# Altium project HU_SUPPORT_BOARD.PrjPcb (part 2 of 2)

## Sheet ADC088S022.SchDoc
size A4; SheetNumber: 6; SheetTotal: 7
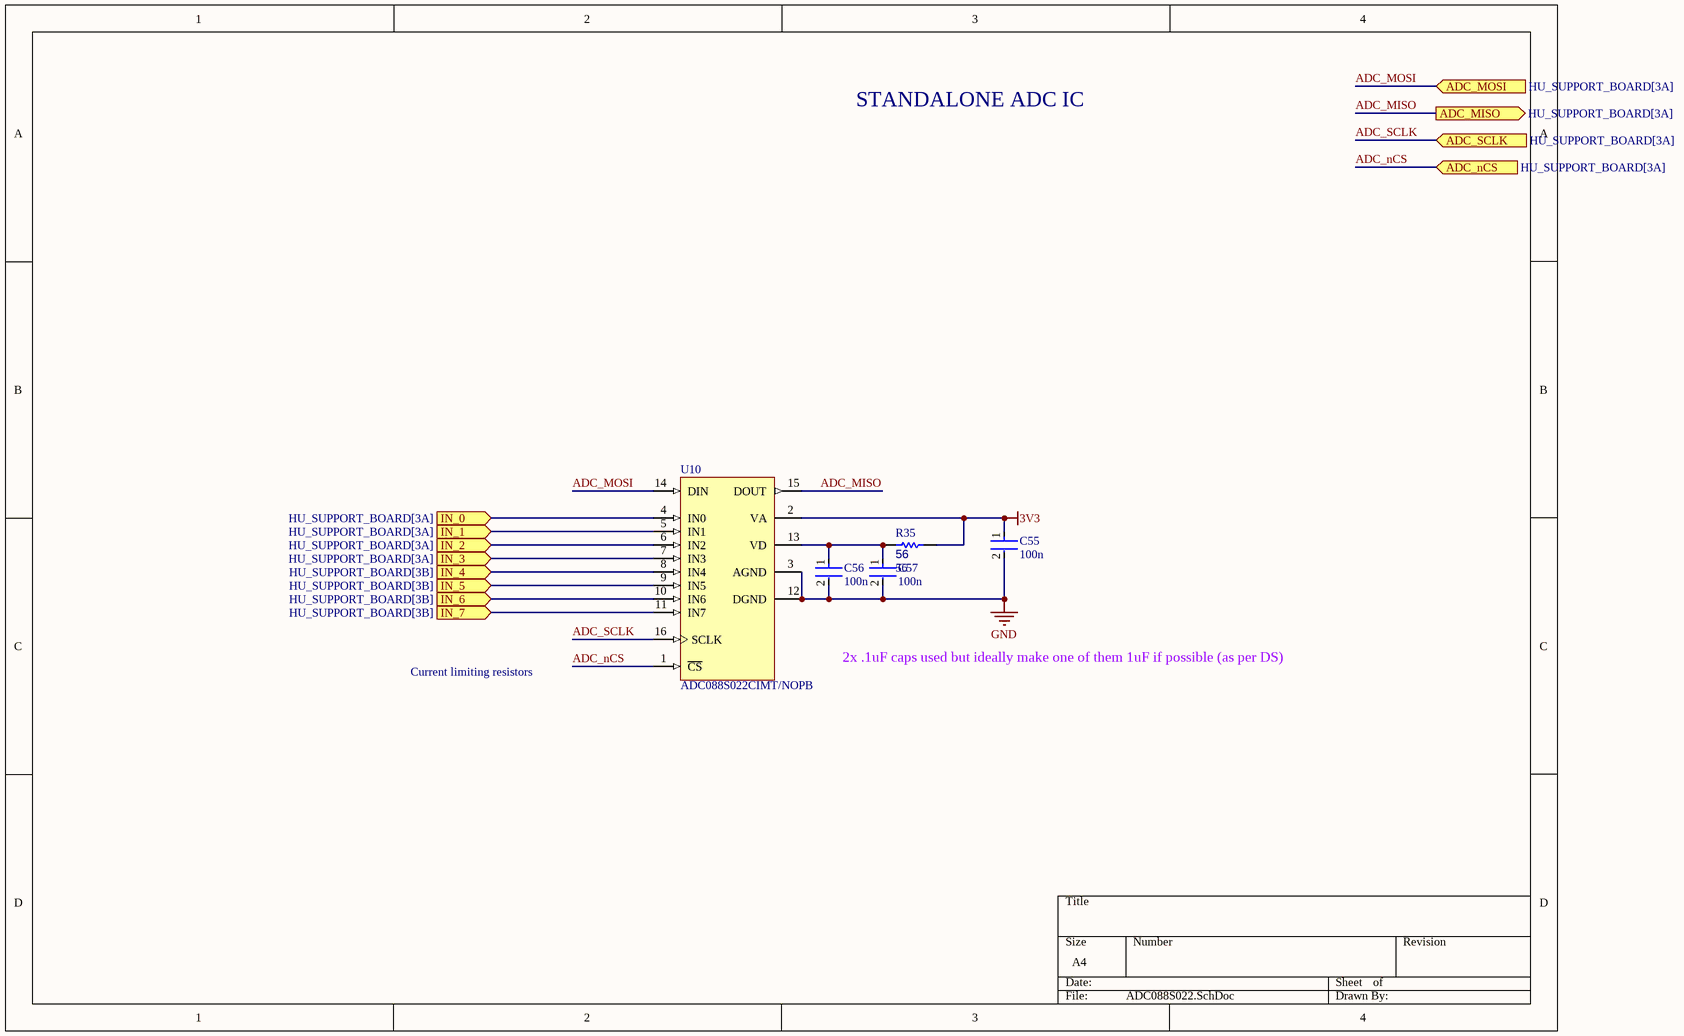
[diagram p9: ADC088S022.SchDoc]

### Parts
C55  100n  [FP-0402-L_1_0_0_05-W_0_5-IPC_A]
C56  100n  [FP-0402-L_1_0_0_05-W_0_5-IPC_A]
C57  100n  [FP-0402-L_1_0_0_05-W_0_5-IPC_A]
R35  56  [R0603B]
U10  ADC088S022CIMT/NOPB  [MTC16_L]

### Ports
ADC_MISO (out, see HU_SUPPORT_BOARD[3A]), ADC_MOSI (in, see HU_SUPPORT_BOARD[3A]), ADC_nCS (in, see HU_SUPPORT_BOARD[3A]), ADC_SCLK (in, see HU_SUPPORT_BOARD[3A]), IN_0 (in, see HU_SUPPORT_BOARD[3A]), IN_1 (in, see HU_SUPPORT_BOARD[3A]), IN_2 (in, see HU_SUPPORT_BOARD[3A]), IN_3 (in, see HU_SUPPORT_BOARD[3A]), IN_4 (in, see HU_SUPPORT_BOARD[3B]), IN_5 (in, see HU_SUPPORT_BOARD[3B]), IN_6 (in, see HU_SUPPORT_BOARD[3B]), IN_7 (in, see HU_SUPPORT_BOARD[3B])

### Nets
3V3: C55.1 R35.1 U10.2(VA)
GND: C55.2 C56.2 C57.2 U10.3(AGND) U10.12(DGND)
ADC_MISO: U10.15(DOUT) ; port ADC_MISO
ADC_MOSI: U10.14(DIN) ; port ADC_MOSI
ADC_nCS: U10.1(~{CS}) ; port ADC_nCS
ADC_SCLK: U10.16(SCLK) ; port ADC_SCLK
NetC56_1: C56.1 C57.1 R35.2 U10.13(VD)
NetR4_5V_REG_0_1: U10.4(IN0) ; port IN_0
NetR4_5V_REG_1_1: U10.6(IN2) ; port IN_2
NetR27_1: U10.9(IN5) ; port IN_5
NetR36_1: U10.8(IN4) ; port IN_4
NetU2_5V_REG_0_7: U10.5(IN1) ; port IN_1
NetU2_5V_REG_1_7: U10.7(IN3) ; port IN_3
NetU7_7: U10.10(IN6) ; port IN_6
NetU10_11: U10.11(IN7) ; port IN_7

### Notes on the sheet
- STANDALONE ADC IC
- Current limiting resistors
- 2x .1uF caps used but ideally make one of them 1uF if possible (as per DS)

### Library data of the parts
C55-C57 = CMP-001-00058-1: LARGE PADS, 0402 CAP, CHANGE COMMENT TO MATCH REAL P/N; Capacitor Type: Ceramic; Min Operating Temperature: -55°C; Mounting Technology: Surface Mount; Pins: 2; Case/Package: 0402; RoHS Compliant: Yes; Max Operating Temperature: 85°C
R35 = CMP-009-00002-14: Resistor; Value: 56
U10 = CMP-0054-00372-2: 8-Channel, 50 kSPS to 200 kSPS, 8-Bit A/D Converter, 16-pin TSSOP, Pb-Free; Manufacturer: National Semiconductor; PackageTopMarking: NSUZXYTT*88S022*CIMT; CompType: ADC IC; PowerWise: Y; ComponentLink2URL: http://www.national.com/pf/AD/ADC088S022.html; RoHS: Y; PackageDescription: Molded TSSOP, Jedec, 5 x 4.4 x 0.9mm Body, 16 Lead, 0.65mm Pitch; DatasheetVersion: Feb-2010; PinCount: 16; ComponentLink1Description: ADC088S022 Datasheet; Code_JEDEC: MO-153-AB; ComponentLink3URL: http://www.national.com/packaging/folders/mtc16.html; PackageVersion: revD, Jun-2003; ComponentLink3Description: MTC16 Package Page; RevisionNote: Component URLs added; ComponentLink1URL: http://www.national.com/ds/AD/ADC088S022.pdf; ComponentLink2Description: ADC088S022 Web Page; PackageReference: MTC16

## Sheet 3V3_LDO.SchDoc
size A4; SheetNumber: 7; SheetTotal: 7
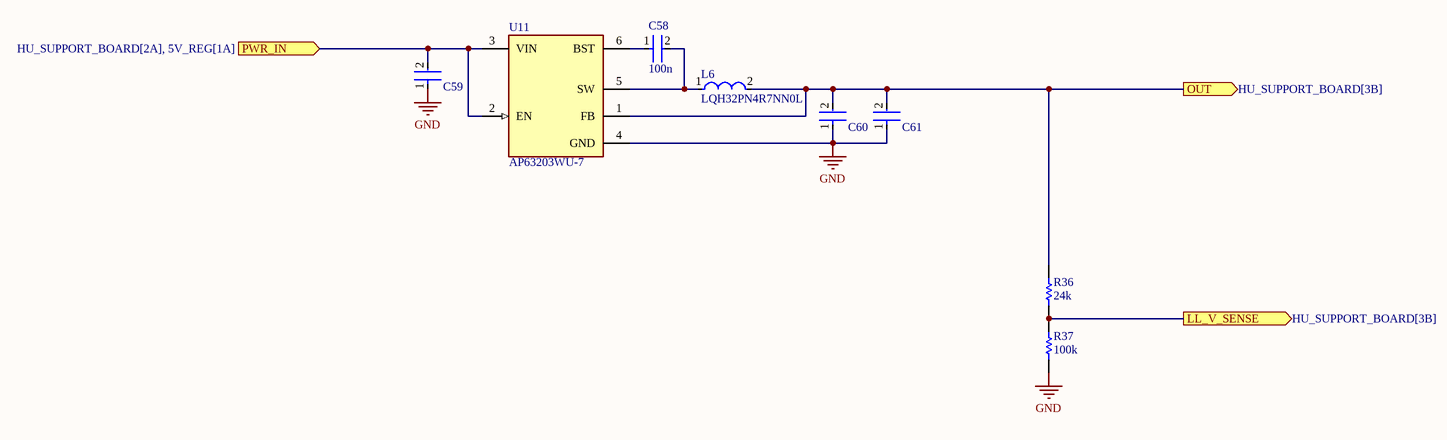
[diagram p10: 3V3_LDO.SchDoc]

### Parts
C58  100n  [FP-0402-L_1_0_0_05-W_0_5-IPC_A]
C59  GRM21BR61E226ME44L  [FP-GRM21B-0_2-e0_2_0_7-IPC_B]  (value not drawn)
C60  GRM21BR61E226ME44L  [FP-GRM21B-0_2-e0_2_0_7-IPC_B]  (value not drawn)
C61  GRM21BR61E226ME44L  [FP-GRM21B-0_2-e0_2_0_7-IPC_B]  (value not drawn)
L6  LQH32PN4R7NN0L  [FP-LQH32PB_N0-MFG]
R36  24k  [R0603B]
R37  100k  [R0603B]
U11  AP63203WU-7  [FP-TSOT26-MFG]

### Ports
LL_V_SENSE (out, see HU_SUPPORT_BOARD[3B]), OUT (out, see HU_SUPPORT_BOARD[3B]), PWR_IN (in, see HU_SUPPORT_BOARD[2A], 5V_REG[1A])

### Nets
3V3: C60.2 C61.2 L6.2 R36.2 U11.1(FB) ; port OUT
GND: C59.1 C60.1 C61.1 R37.1 U11.4(GND)
PoC_PWR: C59.2 U11.2(EN) U11.3(VIN) ; port PWR_IN
NetC58_1: C58.1 U11.6(BST)
NetC58_2: C58.2 L6.1 U11.5(SW)
NetR36_1: R36.1 R37.2 ; port LL_V_SENSE

### Library data of the parts
C58 = CMP-001-00058-1: as C55 on sheet ADC088S022; Min Operating Temperature: -55°C; Mounting Technology: Surface Mount; Pins: 2; Case/Package: 0402; RoHS Compliant: Yes; Max Operating Temperature: 85°C
C59-C61 = CMP-2007-03222-3: Chip Multilayer Ceramic Capacitors for General Purpose, 0805, 22uF, X5R, 15%, 20%, 25V; Case/Package: 0805; Depth: 1.25mm; Resistor Type: Ceramic; Voltage Rating: 25V; Lead Free: Lead Free; Voltage Rating (DC): 25V; Case Code (Metric): 2012; Thickness: 0.057inch; REACH SVHC: No SVHC; Material: Ceramic; Tolerance: 20%; Length: 2mm; Capacitance: 22uF; Case Code (Imperial): 0805; Max Operating Temperature: 85°C; Termination: SMD/SMT; Weight: 0.000335oz; Dielectric: X5R; Packaging: Tape and Reel; Voltage: 25V; Package Quantity: 3000; Height: 1.25mm; Mount: Surface Mount; Width: 1.25mm; Min Operating Temperature: -55°C
L6 = CMP-06042-015002-1: Wire Wound Ferrite Inductor for Power Lines 4.7μH ±30% 0.216Ω 1000mA 1210; DC Current: 1A; Self Resonant Frequency: 40MHz; Test Frequency: 1MHz; Inductance: 4.7uH; Shielding: Shielded; DC Resistance (DCR): 180mR; Case/Package: 1210; Lead Free: Lead Free; Inductance Tolerance: 30%; Depth: 2.8mm; Radiation Hardening: No; Case Code (Imperial): 1210; Length: 3.2mm; Height - Seated (Max): 0.067inch; Current Rating: 1A; Max DC Current: 1A; Core Material: Ferrite; Resistor Type: Wirewound; Max Operating Temperature: 85°C; Weight: 0.001552oz; Tolerance: 30%; Width: 0.098inch; Mount: Surface Mount; Height: 2mm; Termination: SMD/SMT; Package Quantity: 2000; Min Operating Temperature: -40°C; Saturation Current: 1A; Packaging: Tape and Reel; Case Code (Metric): 3225; REACH SVHC: No SVHC; Military Standard: Not
R36 R37 = CMP-009-00002-14: Resistor
U11 = CMP-12757-000006-1: IC REG BUCK 3.3V 2A TSOT26; Manufacturer: Diodes Inc.; Output Type: Fixed; Min Supply Voltage: 3.8V; Number Of Outputs: 1; Max Junction Temp: +160°C; Nominal Supply Current: 22uA; Standoff Height: 0.01mm; Switching Frequency: 1.1MHz; Max Supply Voltage: 32V; ComponentLink2Description: Datasheet; Device Class L1: Integrated Circuits (ICs); Temperature: to +160°C; Device Class L3: Voltage Regulators - Switching; RoHS: TRUE; Octopart: https://octopart.com/ap63203wu-7-diodes+inc.-98099550; Output Voltage: 3.3V; Lead Free: Yes; ComponentLink2URL: https://www.diodes.com/assets/Datasheets/AP63200-AP63201-AP63203-AP63205.pdf; Digikey Description: IC REG BUCK 3.3V 2A TSOT26; Footprint Url: https://www.diodes.com/assets/Package-Files/TSOT26.pdf; Ambient Temperature Range High: +85°C; Height: 1mm; Automotive: No; Temperature Range High: +160°C; Switching Topology: Buck; Output Current: 2A; Package: TSOT26; Category: IC; Mouser Description: AP63203 Series 3.3 V 2 A SMT Fixed Low IQ Synchronous Buck - TSOT-26; Device Class L2: Power Management ICs; Ambient Temperature Range Low: -40°C; Manufacturer Part Number: AP63203WU-7

## Nets that join several sheets
3V3: HU_SUPPORT_BOARD (R1.2), TCAN1146_PWR_MGMT (C45.1 C47.1 U7.8 U8.5), 5V_REG_0 (C10_5V_REG_0.2 R2_5V_REG_0.2 U2_5V_REG_0.8), 5V_REG_1 (C10_5V_REG_1.2 U2_5V_REG_1.8), GMSL_DESERIALIZER (9 pins), MCP2518_PINOUT (5 pins), ADC088S022 (C55.1 R35.1 U10.2), 3V3_LDO (5 pins)
5VA: HU_SUPPORT_BOARD (P1.2 P1.4), 5V_REG_0 (R4_5V_REG_0.2 U2_5V_REG_0.3 U2_5V_REG_0.4)
5VB: HU_SUPPORT_BOARD (F2.2), 5V_REG_1 (R4_5V_REG_1.2 U2_5V_REG_1.3 U2_5V_REG_1.4)
GND: HU_SUPPORT_BOARD (24 pins), TCAN1146_PWR_MGMT (19 pins), 5V_REG_0 (15 pins), 5V_REG_1 (15 pins), GMSL_DESERIALIZER (35 pins), MCP2518_PINOUT (6 pins), ADC088S022 (5 pins), 3V3_LDO (5 pins)
PoC_PWR: HU_SUPPORT_BOARD (J4.7 J4.8 J5.7 J5.8), TCAN1146_PWR_MGMT (5 pins), 5V_REG_0 (5 pins), 5V_REG_1 (5 pins), GMSL_DESERIALIZER (F1.1), 3V3_LDO (C59.2 U11.2 U11.3)
5VB_LL_EN: HU_SUPPORT_BOARD (P1.27 R1.1), 5V_REG_1 (R2_5V_REG_1.2)
ADC_MISO: HU_SUPPORT_BOARD (P1.35), ADC088S022 (U10.15)
ADC_MOSI: HU_SUPPORT_BOARD (P1.38), ADC088S022 (U10.14)
ADC_nCS: HU_SUPPORT_BOARD (P1.12), ADC088S022 (U10.1)
ADC_SCLK: HU_SUPPORT_BOARD (P1.40), ADC088S022 (U10.16)
CAM_I2C_SCL: HU_SUPPORT_BOARD (J2.13), GMSL_DESERIALIZER (R7.1 R11.1 R12.1)
CAM_I2C_SDA: HU_SUPPORT_BOARD (J2.14), GMSL_DESERIALIZER (R6.1 R8.1 R9.1)
CAM_nPWDN: HU_SUPPORT_BOARD (J2.11), GMSL_DESERIALIZER (R13.1 U3.11)
CAN_MISO: HU_SUPPORT_BOARD (P1.21), TCAN1146_PWR_MGMT (U8.6), MCP2518_PINOUT (U6.12)
CAN_MOSI: HU_SUPPORT_BOARD (P1.19), TCAN1146_PWR_MGMT (U8.11), MCP2518_PINOUT (U6.11)
CAN_N: HU_SUPPORT_BOARD (J3.19), TCAN1146_PWR_MGMT (C49.1 D5.1 L5.4 R33.2)
CAN_nCS: HU_SUPPORT_BOARD (P1.26), TCAN1146_PWR_MGMT (U8.14)
CAN_P: HU_SUPPORT_BOARD (J3.18), TCAN1146_PWR_MGMT (C51.2 D5.2 L5.1 R34.1)
CAN_RX: TCAN1146_PWR_MGMT (U8.4), MCP2518_PINOUT (U6.2)
CAN_SCLK: HU_SUPPORT_BOARD (P1.23), TCAN1146_PWR_MGMT (U8.8), MCP2518_PINOUT (U6.10)
CAN_TX: TCAN1146_PWR_MGMT (U8.1), MCP2518_PINOUT (U6.1)
CSI_CLK_N: HU_SUPPORT_BOARD (J2.8), GMSL_DESERIALIZER (C16.2)
CSI_CLK_P: HU_SUPPORT_BOARD (J2.9), GMSL_DESERIALIZER (C15.2)
CSI_D0_N: HU_SUPPORT_BOARD (J2.2), GMSL_DESERIALIZER (C12.2)
CSI_D0_P: HU_SUPPORT_BOARD (J2.3), GMSL_DESERIALIZER (C11.2)
CSI_D1_N: HU_SUPPORT_BOARD (J2.5), GMSL_DESERIALIZER (C14.2)
CSI_D1_P: HU_SUPPORT_BOARD (J2.6), GMSL_DESERIALIZER (C13.2)
MCP2518_nCS: HU_SUPPORT_BOARD (P1.24), MCP2518_PINOUT (U6.13)
MCP2518_nINT: HU_SUPPORT_BOARD (P1.29), MCP2518_PINOUT (R21.2 U6.4)
MCP2518_nINT0: HU_SUPPORT_BOARD (P1.31), MCP2518_PINOUT (R22.2 U6.9)
MCP2518_nINT1: HU_SUPPORT_BOARD (P1.33), MCP2518_PINOUT (R23.2 U6.8)
NetR4_5V_REG_0_1: 5V_REG_0 (R4_5V_REG_0.1 R5_5V_REG_0.2), ADC088S022 (U10.4)
NetR4_5V_REG_1_1: 5V_REG_1 (R4_5V_REG_1.1 R5_5V_REG_1.2), ADC088S022 (U10.6)
NetR27_1: TCAN1146_PWR_MGMT (R27.1 R29.2), ADC088S022 (U10.9)
NetR36_1: ADC088S022 (U10.8), 3V3_LDO (R36.1 R37.2)
NetU2_5V_REG_0_7: 5V_REG_0 (U2_5V_REG_0.7), ADC088S022 (U10.5)
NetU2_5V_REG_1_7: 5V_REG_1 (U2_5V_REG_1.7), ADC088S022 (U10.7)
NetU7_7: TCAN1146_PWR_MGMT (U7.7), ADC088S022 (U10.10)
PoC_A: HU_SUPPORT_BOARD (J1.1), GMSL_DESERIALIZER (C17.2 D2.1 D2.10 L4.2)
RAW_PWR: HU_SUPPORT_BOARD (J3.16 J3.17), TCAN1146_PWR_MGMT (XF1.1 XF1.2)
RPI_3V3: HU_SUPPORT_BOARD (J2.15), GMSL_DESERIALIZER (C37.2 C38.2 U3.24)